# Altium schematic sheet Battery_Management _rev3.SchDoc
size A; SheetNumber: 2; SheetTotal: 4
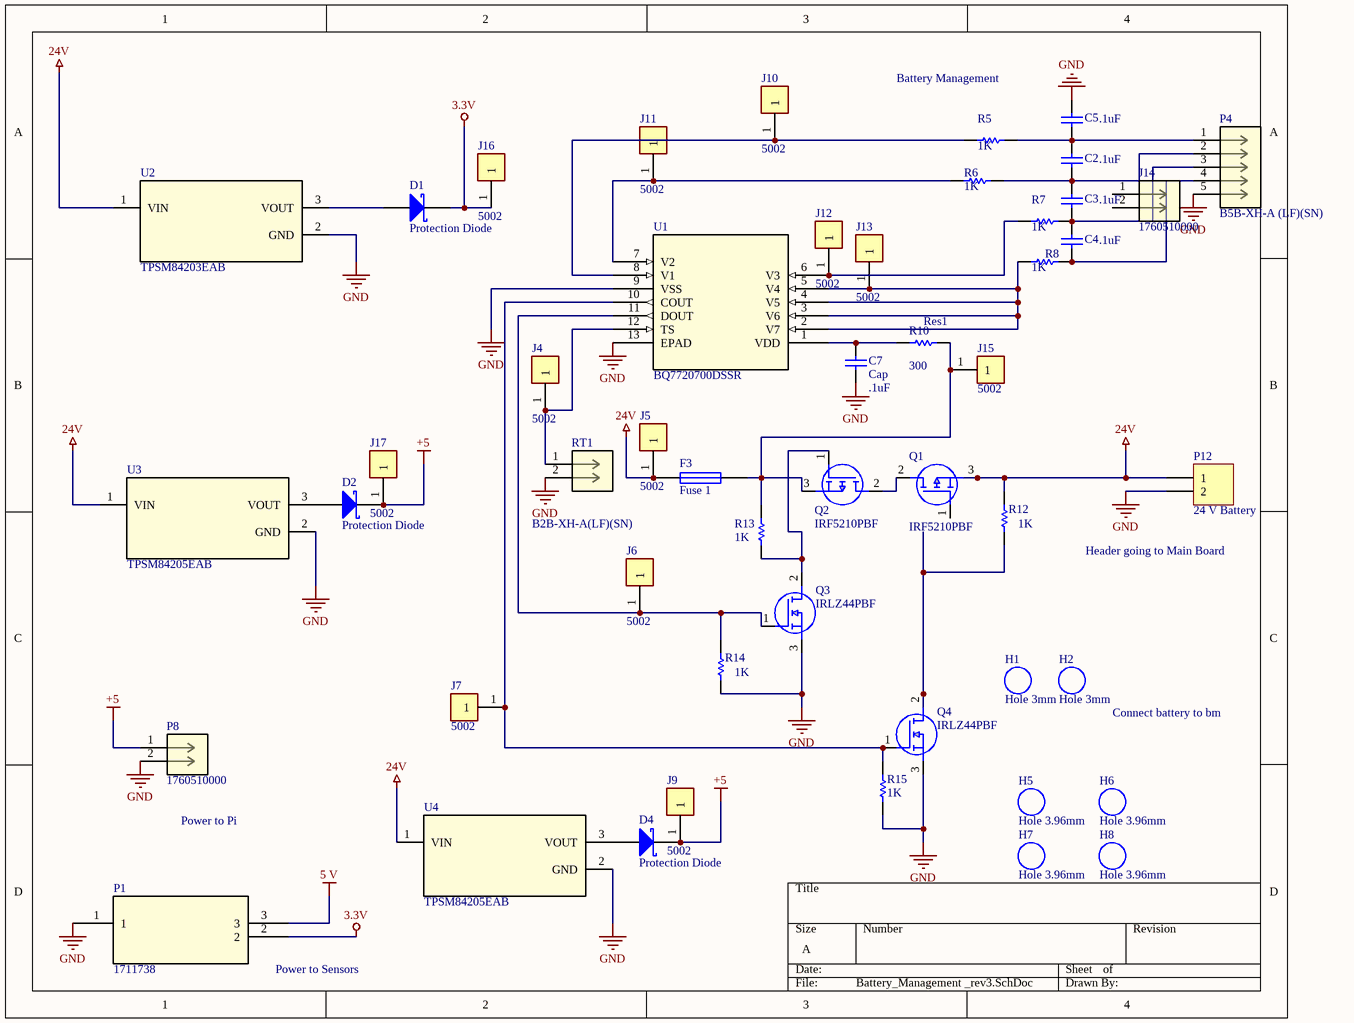
[diagram p0: Battery_Management _rev3.SchDoc]

## Parts
C2  value .1uF  [RAD-0.3]  (hidden comment: Cap)
C3  value .1uF  [RAD-0.3]  (hidden comment: Cap)
C4  value .1uF  [RAD-0.3]  (hidden comment: Cap)
C5  value .1uF  [RAD-0.3]  (hidden comment: Cap)
C7  Cap  value .1uF  [RAD-0.3]
D1  Protection Diode  [TO-220AC]
D2  Protection Diode  [TO-220AC]
D4  Protection Diode  [TO-220AC]
F3  Fuse 1  [PIN-W2/E2.8]
H1  Hole 3mm  [Hole 3mm]
H2  Hole 3mm  [Hole 3mm]
H5  Hole 3.96mm  [Hole 3mm]
H6  Hole 3.96mm  [Hole 3mm]
H7  Hole 3.96mm  [Hole 3mm]
H8  Hole 3.96mm  [Hole 3mm]
J4  5002  [KEYSTONE_5002]
J5  5002  [KEYSTONE_5002]
J6  5002  [KEYSTONE_5002]
J7  5002  [KEYSTONE_5002]
J9  5002  [KEYSTONE_5002]
J10  5002  [KEYSTONE_5002]
J11  5002  [KEYSTONE_5002]
J12  5002  [KEYSTONE_5002]
J13  5002  [KEYSTONE_5002]
J14  1760510000  [CONN2_1760510000_WED]
J15  5002  [KEYSTONE_5002]
J16  5002  [KEYSTONE_5002]
J17  5002  [KEYSTONE_5002]
P1  1711738  [1711738_PXC]
P4  B5B-XH-A (LF)(SN)  [CONN_B5B-XH-A (LF)(SN)_JST]
P8  1760510000  [CONN2_1760510000_WED]
P12  24 V Battery  [MHDR1X2]
Q1  IRF5210PBF  [TO254P469X1042X1967-3P]
Q2  IRF5210PBF  [TO254P469X1042X1967-3P]
Q3  IRLZ44PBF  [TO254P465X1024X2050-3P]
Q4  IRLZ44PBF  [TO254P465X1024X2050-3P]
R5  value 1K  [AXIAL-0.3]
R6  value 1K  [AXIAL-0.3]  (hidden comment: Res1)
R7  value 1K  [AXIAL-0.3]
R8  value 1K  [AXIAL-0.3]  (hidden comment: Res1)
R10  Res1  value 300  [AXIAL-0.3]
R12  value 1K  [AXIAL-0.3]  (hidden comment: Res1)
R13  value 1K  [AXIAL-0.3]  (hidden comment: Res1)
R14  value 1K  [AXIAL-0.3]  (hidden comment: Res1)
R15  value 1K  [AXIAL-0.3]  (hidden comment: Res1)
RT1  B2B-XH-A(LF)(SN)  [CONN_B2B-XH-A(LF)(SN)_JST]
U1  BQ7720700DSSR  [WSON12_DSS_TEX]
U2  TPSM84203EAB  [EAB0003A]
U3  TPSM84205EAB  [EAB0003A]
U4  TPSM84205EAB  [EAB0003A]

## Nets
3.3V: D1.1(K) J16.1 P1.2
5 V: P1.3
24V: F3.2 J5.1 P12.1 Q1.3(S) R12.2 U2.1(VIN) U3.1(VIN) U4.1(VIN)
+5: D2.1(K) D4.1(K) J9.1 J17.1 P8.1
GND: C5.2 C7.1 P1.1 P4.5 P8.2 P12.2 Q3.3(S) Q4.3(S) R14.1 R15.1 RT1.2 U1.9(VSS) U1.13(EPAD) U2.2(GND) U3.2(GND) U4.2(GND)
NetC2_1: C2.1 C3.2 P4.2 R6.2
NetC2_2: C2.2 C5.1 P4.1 R5.2
NetC3_1: C3.1 C4.2 P4.3 R7.2
NetC4_1: C4.1 P4.4 R8.2
NetC7_2: C7.2 R10.1 U1.1(VDD)
NetD1_3: D1.3(A) U2.3(VOUT)
NetD2_3: D2.3(A) U3.3(VOUT)
NetD4_3: D4.3(A) U4.3(VOUT)
NetF3_1: F3.1 J15.1 Q2.3(S) R10.2 R13.2
NetJ4_1: J4.1 RT1.1 U1.12(TS)
NetJ6_1: J6.1 Q3.1(G) R14.2 U1.11(DOUT)
NetJ7_1: J7.1 Q4.1(G) R15.2 U1.10(COUT)
NetJ10_1: J10.1 R5.1 U1.8(V1)
NetJ11_1: J11.1 R6.1 U1.7(V2)
NetJ12_1: J12.1 R7.1 U1.6(V3)
NetJ13_1: J13.1 R8.1 U1.2(V7) U1.3(V6) U1.4(V5) U1.5(V4)
NetQ1_2: Q1.2(D) Q2.2(D)
NetQ2_1: Q2.1(G) Q3.2(D) R13.1
NetQ4_2: Q4.2(D) R12.1

Not connected (* = marked no-connect by the designer): J14 1 2; Q1 1(G)

## Notes on the sheet
- Battery Management
- Header going to Main Board
- (near H2) Connect battery to bm
- Power to Pi
- (near P1) Power to Sensors

## Library data of the parts
C2-C5 C7 = Cap: Capacitor; Published: 8-Jun-2000; LatestRevisionDate: 17-Jul-2002; LatestRevisionNote: Re-released for DXP Platform.; PackageReference: RAD-0.3; Publisher: Altium Limited; PackageDescription: Radial Cap, Thru-Hole; 2 Leads; 0.3 in Pin Spacing
D1 D2 D4 = Diode 10TQ035: Schottky Rectifier; Note: Terminal 2 is the TAB and is electrically connected to the cathode; Published: 8-Jun-2000; LatestRevisionDate: 17-Jul-2002; LatestRevisionNote: Re-released for DXP Platform.; DatasheetVersion: PD-2.057B; PackageVersion: Feb-1998; PackageReference: TO-220AC; Publisher: Altium Limited; PackageDescription: TO, Thru-Hole, Vertical, Heatsink Mounted; 3 In-Line Leads (1 Absent); Pitch 2.54 mm; ComponentLink1Description: Manufacturer Link; ComponentLink1URL: http://www.irf.com/; ComponentLink2Description: Datasheet; ComponentLink2URL: http://www.irf.com/product-info/datasheets/data/10tq.pdf
F3 = Fuse 1: Fuse; Published: 8-Jun-2000; LatestRevisionDate: 17-Jul-2002; LatestRevisionNote: Re-released for DXP Platform.; PackageReference: PIN-W2/E2.8; Publisher: Altium Limited; PackageDescription: Thru-Hole; 2 Leads
H5-H8 = Hole 3mm
J4-J7 J9-J13 J15-J17 = 5002: 2.2ÂµH Shielded Wirewound Inductor 1.8A 66mOhm Max Nonstandard; MF: Keystone Electronics; Price: None; MP: 5002; Availability: Unavailable; SnapEDA_Link: https://www.snapeda.com/parts/5002/Keystone%20Electronics/view-part/500797/?ref=snap; Value: *; Mouser-Purchase-URL: https://snapeda.com/shop?store=Mouser&id=500797; Package: Test Point Keystone Electronics
J14 P8 = 1760510000: No Description Available; Mfr_Name: Weidmuller; Copyright: Copyright (C) 2022 Ultra Librarian. All rights reserved.; Manufacturer_Part_Number: 1760510000; Digi-Key_Part_Number_1: 281-1882-ND; RefDes: RefDes; Type: DEV
P1 = 1711738: No Description Available; Mfr_Name: Phoenix Contact; Copyright: Copyright (C) 2022 Ultra Librarian. All rights reserved.; Manufacturer_Part_Number: 1711738; Digi-Key_Part_Number_1: 277-1028-ND; RefDes: RefDes; Type: DEV
P4 = B5B-XH-A (LF)(SN): No Description Available; Mfr_Name: JST; Copyright: Copyright (C) 2022 Ultra Librarian. All rights reserved.; Manufacturer_Part_Number: B5B-XH-A (LF)(SN); Digi-Key_Part_Number_1: 455-2270-ND; RefDes: RefDes; Type: DEV
P12 = MHDR1X2: Header, 2-Pin; LatestRevisionDate: 17-Jul-2002; LatestRevisionNote: Re-released for DXP Platform.; Publisher: Altium Limited
Q1 Q2 = IRF5210PBF: MOSFET P-Channel 100V 40A TO220AB Infineon IRF5210PBF P-channel MOSFET Transistor, 40 A, 100 V, 3-Pin TO-220AB; Geometry.Height: 4.69mm; Mouser Part Number: 942-IRF5210PBF; Mouser Price/Stock: https://www.mouser.co.uk/ProductDetail/Infineon-Technologies/IRF5210PBF?qs=9%252BKlkBgLFf3S3YiL4ijtLg%3D%3D; Manufacturer_Name: Infineon; Manufacturer_Part_Number: IRF5210PBF; Datasheet Link: https://datasheet.datasheetarchive.com/originals/distributors/Datasheets_SAMA/282f86ced5e538d8a52fd01096578d56.pdf
Q3 Q4 = IRLZ44PBF: Trans MOSFET N-CH 60V 50A; Manufacturer_Name: Vishay; Geometry.Height: 4.65mm; Mouser Part Number: 844-IRLZ44PBF; Mouser Price/Stock: https://www.mouser.co.uk/ProductDetail/Vishay-Semiconductors/IRLZ44PBF?qs=cvaI6Thkwxs%2F%2FLKnrdRUbA%3D%3D; Manufacturer_Part_Number: IRLZ44PBF; Datasheet Link: https://datasheet.datasheetarchive.com/originals/distributors/Datasheets-DGA24/1593196.pdf
R5-R8 R10 R12-R15 = Res1: Resistor; Published: 8-Jun-2000; LatestRevisionDate: 17-Jul-2002; LatestRevisionNote: Re-released for DXP Platform.; PackageReference: AXIAL-0.3; Publisher: Altium Limited; PackageDescription: Axial Device, Thru-Hole; 2 Leads; 0.3 in Pin Spacing
RT1 = B2B-XH-A(LF)(SN): fOR RT; Mfr_Name: JST; Copyright: Copyright (C) 2022 Ultra Librarian. All rights reserved.; Manufacturer_Part_Number: B2B-XH-A(LF)(SN); Digi-Key_Part_Number_1: 455-2247-ND; RefDes: RefDes; Type: DEV
U1 = BQ7720700DSSR: No Description Available; Mfr_Name: Texas Instruments; Copyright: Copyright (C) 2022 Ultra Librarian. All rights reserved.; Manufacturer_Part_Number: BQ7720700DSSR; RefDes: RefDes; Type: DEV
U2 = TPSM84203EAB: No Description Available; Mfr_Name: Texas Instruments; Type: DEV; RefDes: RefDes; Copyright: Copyright (C) 2022 Ultra Librarian. All rights reserved.; Manufacturer_Part_Number: TPSM84203EAB
U3 U4 = TPSM84205EAB_1: No Description Available; Mfr_Name: Texas Instruments; Type: DEV; RefDes: RefDes; Copyright: Copyright (C) 2022 Ultra Librarian. All rights reserved.; Manufacturer_Part_Number: TPSM84205EAB